# EAGLE design CDST_final_PCB_v1.0 (EAGLE 8.4.2)
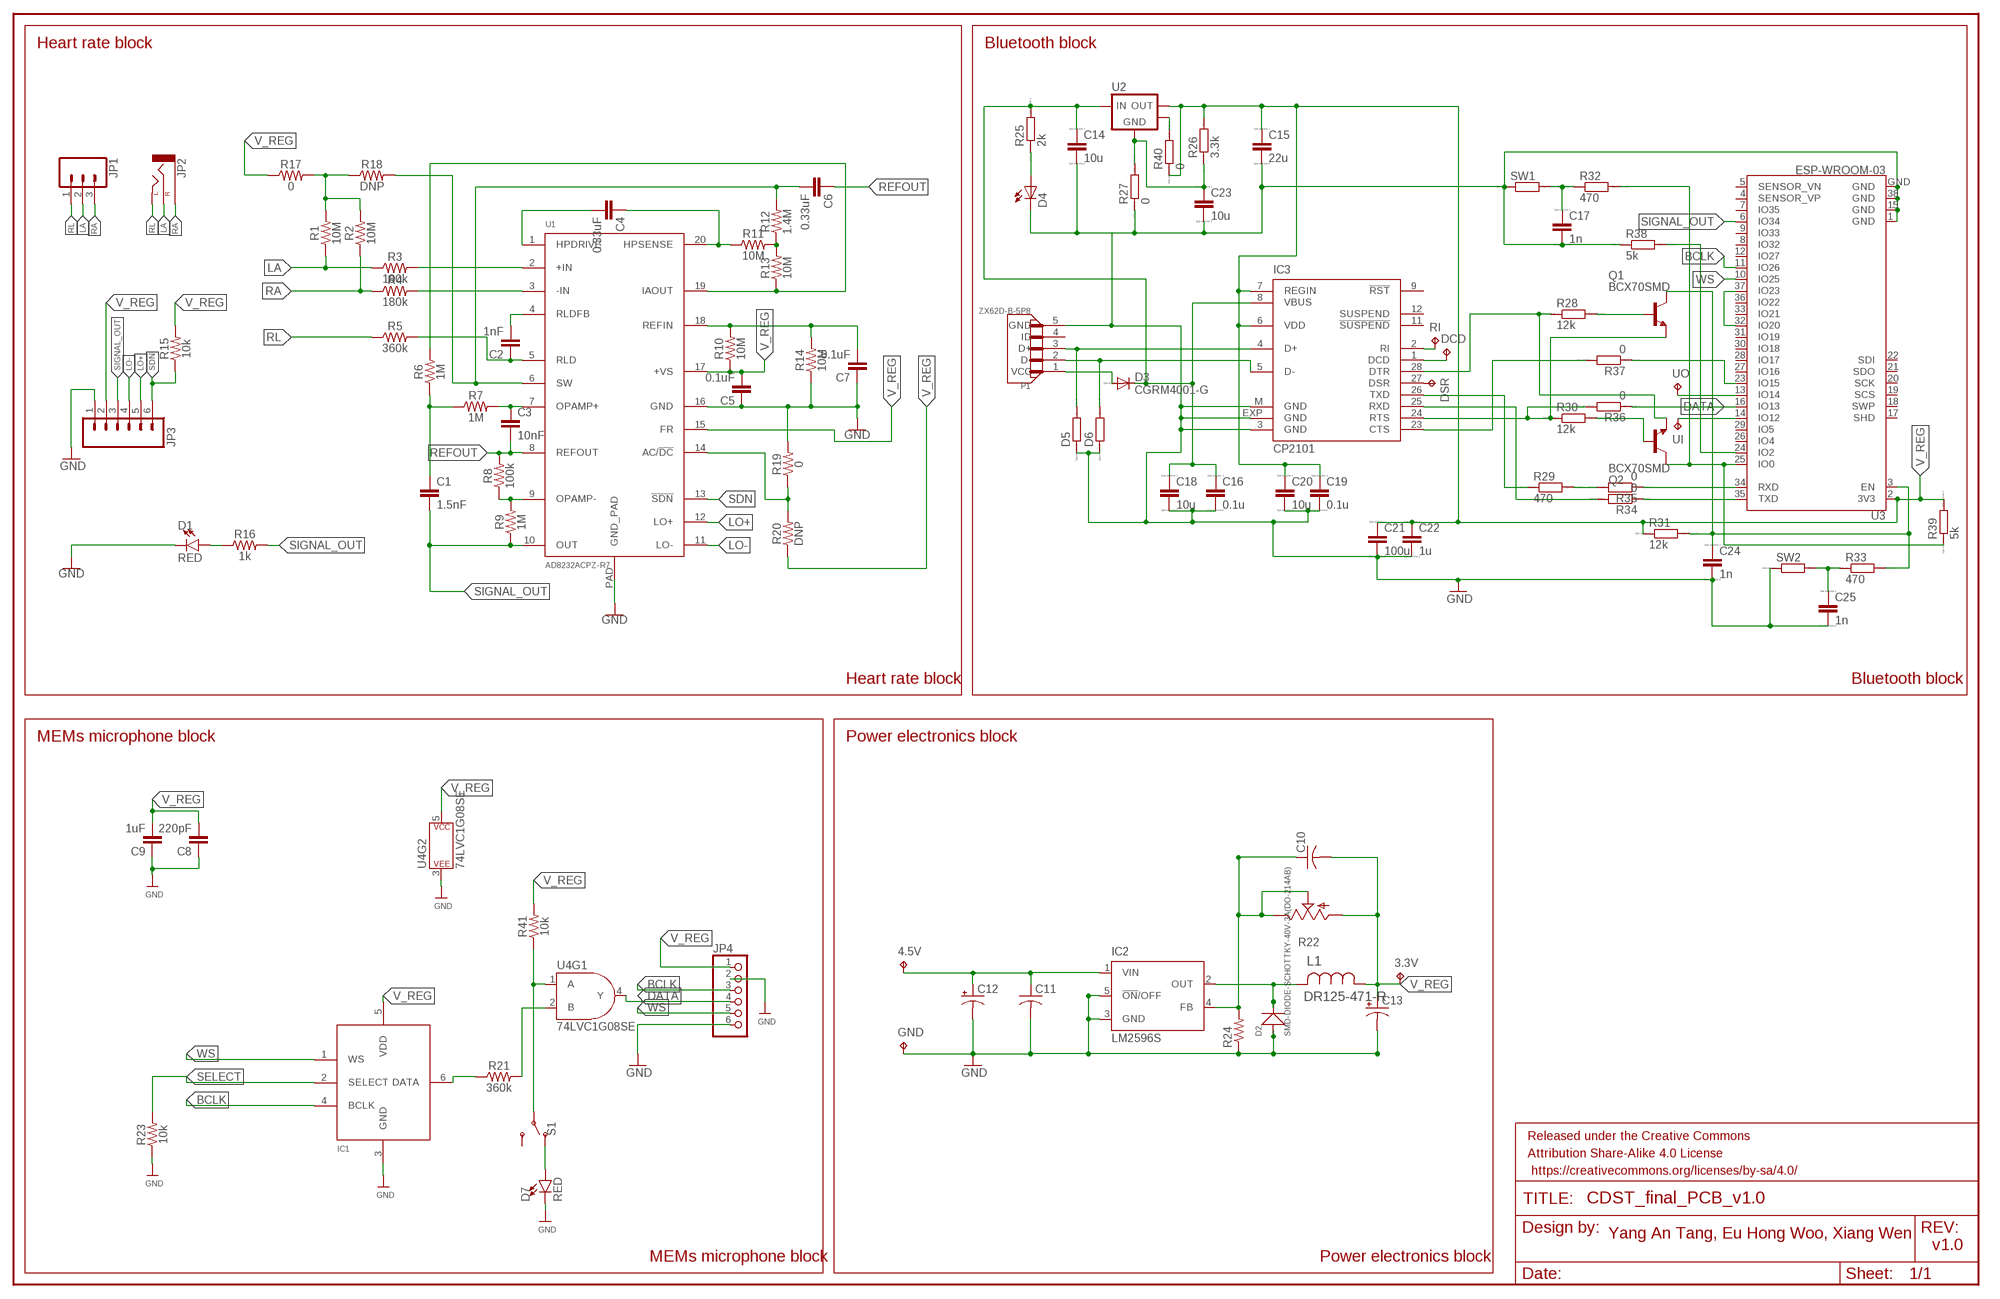
[diagram p0: schematic, sheet 1]

## Parts
3.3V  TPTP20SQ  [TP20SQ]
4.5V  TPTP20SQ  [TP20SQ]
C1  1.5nF  C-EUC1206  [C1206]
C2  1nF  C-EUC1206  [C1206]
C3  10nF  C-EUC1206  [C1206]
C4  0.33uF  C-EUC1206  [C1206]
C5  0.1uF  C-EUC1206  [C1206]
C6  0.33uF  C-EUC1206  [C1206]
C7  0.1uF  C-EUC1206  [C1206]
C8  220pF  C-EUC1206  [C1206]
C9  1uF  C-EUC1206  [C1206]
C10  C-USC0402  [C0402]
C11  C-USC0402  [C0402]
C12  CPOL-USSANYO_SMD_F8  [SANYO-OSCON_SMD_F8]
C13  CPOL-USSANYO_SMD_F8  [SANYO-OSCON_SMD_F8]
C14  10u  CC1206  [C1206]
C15  22u  CC1206  [C1206]
C16  0.1u  CC1206  [C1206]
C17  1n  CC1206  [C1206]
C18  10u  CC1206  [C1206]
C19  0.1u  CC1206  [C1206]
C20  10u  CC1206  [C1206]
C21  100u  CC1206  [C1206]
C22  1u  CC1206  [C1206]
C23  10u  CC1206  [C1206]
C24  1n  CC1206  [C1206]
C25  1n  CC1206  [C1206]
D1  RED  LED-RED1206  [LED-1206]
D2  SMD-DIODE-SCHOTTKY-40V-3A(DO-214AB)  [DO-214AB]
D3  CGRM4001-G  [SOD-123_MINI-SMA]
D4  LEDCHIPLED_0805  [CHIPLED_0805]
D5  RR0402  [R0402]
D6  RR0402  [R0402]
D7  RED  LED-RED1206  [LED-1206]
DCD  TPB2,54  [B2,54]
DSR  TPB2,54  [B2,54]
FRAME1  FRAME-LEDGER  [CREATIVE_COMMONS]
GND  TPTP20SQ  [TP20SQ]
IC1  MIC_I2S_SPH0645  [SPH0645LM4H]
IC2  LM2596S  [TO263-5]
IC3  CP2101  [MLP28]
JP1  M03PTH  [1X03]
JP2  AUDIO-JACKSMD2  [AUDIO-JACK-3.5MM-SMD]
JP3  M06SIP  [1X06]
JP4  HEADER-1X6ROUND  [1X06_ROUND]
L1  DR125-471-R  [INDM125125X600N]
P1  ZX62D-B-5P8  [HRS_ZX62D-B-5P8]
Q1  BCX70SMD  [SOT23]
Q2  BCX70SMD  [SOT23]
R1  10M  RESISTOR1206  [1206]
R2  10M  RESISTOR1206  [1206]
R3  180k  RESISTOR1206  [1206]
R4  180k  RESISTOR1206  [1206]
R5  360k  RESISTOR1206  [1206]
R6  1M  RESISTOR1206  [1206]
R7  1M  RESISTOR1206  [1206]
R8  100k  RESISTOR1206  [1206]
R9  1M  RESISTOR1206  [1206]
R10  10M  RESISTOR1206  [1206]
R11  10M  RESISTOR1206  [1206]
R12  1.4M  RESISTOR1206  [1206]
R13  10M  RESISTOR1206  [1206]
R14  10M  RESISTOR1206  [1206]
R15  10k  RESISTOR1206  [1206]
R16  1k  RESISTOR1206  [1206]
R17  0  RESISTOR1206  [1206]
R18  DNP  RESISTOR1206  [1206]
R19  0  RESISTOR1206  [1206]
R20  DNP  RESISTOR1206  [1206]
R21  360k  RESISTOR1206  [1206]
R22  TRIM_US-RJ9W  [RJ9W]
R23  10k  RESISTOR1206  [1206]
R24  R-US_MELF0204W  [MINI_MELF-0204W]
R25  2k  RR1206  [R1206]
R26  3.3k  RR1206  [R1206]
R27  0  RR1206  [R1206]
R28  12k  RR1206  [R1206]
R29  470  RR1206  [R1206]
R30  12k  RR1206  [R1206]
R31  12k  RR1206  [R1206]
R32  470  RR1206  [R1206]
R33  470  RR1206  [R1206]
R34  0  RR1206  [R1206]
R35  0  RR1206  [R1206]
R36  0  RR1206  [R1206]
R37  0  RR1206  [R1206]
R38  5k  RR1206  [R1206]
R39  5k  RR1206  [R1206]
R40  0  RR1206  [R1206]
R41  10k  RESISTOR1206  [1206]
RI  TPB2,54  [B2,54]
S1  SWITCH-SPDT-SMD-RIGHT-ANGLE  [SWITCH_SPST_SMD_A]
SW1  RR2010  [R2010]
SW2  RR2010  [R2010]
U1  AD8232ACPZ-R7  AD8232  [LFCSP_20]
U2  LM1117-SOT223  [SOT-223-3]
U3  ESP-WROOM-03  [ESP-WROOM-03]
U4  74LVC1G08SE  74LVC08SE  [SOT23-5]
UI  TPB1,27  [B1,27]
UO  TPB1,27  [B1,27]

## Nets
BCLK: IC1.4(BCLK) JP4.3 U3.11(IO26)
DATA: JP4.4 R36.1 U3.16(IO13) U4.4(Y)
DCD: DCD.TP IC3.1(DCD)
GND: C5.1 C7.1 C8.1 C9.1 C11.2 C12.- C13.- C14.2 C15.2 C16.2 C17.2 C18.2 C19.2 C20.2 C21.2 C22.2 C23.1 C23.2 C24.2 C25.2 D1.C D2.1(+) D4.C D5.1 D6.1 D7.C GND.TP IC1.3(GND) IC2.3(GND) IC2.5(!ON!/OFF) IC3.3(GND) IC3.EXP(GND) IC3.M(GND) JP3.1 JP4.2 JP4.6 P1.5(GND) R14.1 R19.2 R23.1 R24.1 R26.1 R27.1 R27.2 R38.1 SW1.1 SW2.1 U1.16(GND) U1.PAD(GND_PAD) U2.1(GND) U3.1(GND) U3.15(GND) U3.38(GND) U3.GND U4.3(P$V-)
HEATSINK: R40.2 U2.4(HEATSINK)
LA: JP1.2 JP2.RING(RIGHT) R1.1 R3.1
LO+: JP3.5 U1.12(LO+)
LO-: JP3.4 U1.11(LO-)
N$1: C4.2 U1.1(HPDRIVE)
N$2: C4.1 R11.1 U1.20(HPSENSE)
N$3: R11.2 R12.1 R13.2
N$4: C6.2 R12.2 R18.2 U1.6(SW)
N$5: C3.1 R7.2 U1.7(OPAMP+)
N$6: 4.5V.TP C11.1 C12.+ IC2.1(VIN)
N$7: R6.2 R13.1 U1.19(IAOUT)
N$8: C1.1 R6.1 R7.1
N$9: D4.A R25.1
N$10: IC1.6(DATA) R21.1
N$11: R8.1 R9.2 U1.9(OPAMP-)
N$12: C10.1 IC2.4(FB) R22.E R22.S R24.2
N$13: R3.2 U1.2(+IN)
N$14: R4.2 U1.3(-IN)
N$15: D1.A R16.1
N$16: R1.2 R2.2 R17.2 R18.1
N$17: C2.2 U1.4(RLDFB)
N$18: C2.1 R5.2 U1.5(RLD)
N$19: C7.2 R10.2 R14.2 U1.18(REFIN)
N$20: C14.1 C16.1 C18.1 D3.C IC3.8(VBUS) R25.2 U2.3(VIN)
N$21: D2.2(-) IC2.2(OUT) L1.2
N$22: R19.1 R20.2 U1.14(AC/!DC)
N$23: D5.2 IC3.4(D+) P1.3(D+)
N$24: D6.2 IC3.5(D-) P1.2(D-)
N$25: D3.A P1.1(VCC)
N$26: Q1.1(B) R28.2
N$27: IC3.24(RTS) Q1.2(E) R30.1 R36.2
N$28: IC3.28(DTR) Q2.2(E) R28.1
N$29: C24.1 Q1.3(C) R31.2 R33.2 U3.3(EN)
N$30: IC3.25(RXD) R34.2
N$31: IC3.26(TXD) R29.1
N$32: U3.13(IO14) UO.TP
N$33: U3.32(IO20) U3.37(IO23)
N$34: C25.1 R33.1 SW2.2
N$35: C17.1 R32.1 SW1.2
N$36: Q2.3(C) R32.2 R39.1 U3.25(IO0)
N$37: R38.2 U3.24(IO2)
N$38: R34.1 U3.35(TXD)
N$39: R29.2 R35.2
N$40: R35.1 U3.34(RXD)
N$41: U3.14(IO12) UI.TP
N$42: IC3.23(CTS) R37.2
N$43: R37.1 U3.23(IO15)
N$44: Q2.1(B) R30.2
N$45: IC3.2(RI) RI.TP
N$46: DSR.TP IC3.27(DSR)
N$47: D7.A S1.1(O)
N$48: R21.2 U4.2(B)
N$49: R41.1 S1.2(P) U4.1(A)
RA: JP1.3 JP2.SLEEVE R2.1 R4.1
REFOUT: C3.2 C6.1 R8.2 U1.8(REFOUT)
RL: JP1.1 JP2.TIP(LEFT) R5.1
SDN: JP3.6 R15.1 U1.13(!SDN)
SELECT: IC1.2(SELECT) R23.2
SIGNAL_OUT: C1.2 JP3.3 R9.1 R16.2 U1.10(OUT) U3.6(IO34)
V_REG: 3.3V.TP C5.2 C8.2 C9.2 C10.2 C13.+ C15.1 C19.1 C20.1 C21.1 C22.1 IC1.5(VDD) IC3.6(VDD) IC3.7(REGIN) JP3.2 JP4.1 L1.1 R10.1 R15.2 R17.1 R20.1 R22.A R26.2 R31.1 R39.2 R40.1 R41.2 U1.15(FR) U1.17(+VS) U2.2(VOUT) U3.2(3V3) U4.5(P$V+)
WS: IC1.1(WS) JP4.5 U3.10(IO25)
Unconnected: IC3.9(!RST) IC3.11(!SUSPEND) IC3.12(SUSPEND) P1.4(ID) S1.3(S) U3.4(SENSOR_VP) U3.5(SENSOR_VN) U3.7(IO35) U3.8(IO32) U3.9(IO33) U3.12(IO27) U3.17(SHD) U3.18(SWP) U3.19(SCS) U3.20(SCK) U3.21(SDO) U3.22(SDI) U3.26(IO4) U3.27(IO16) U3.28(IO17) U3.29(IO5) U3.30(IO18) U3.31(IO19) U3.33(IO21) U3.36(IO22)

## Notes on the sheet
- Heart rate block | Bluetooth block
- Heart rate block | Bluetooth block
- MEMs microphone block | Power electronics block
- Yang An Tang, Eu Hong Woo, Xiang Wen
- v1.0
- MEMs microphone block | Power electronics block

## Library data of the parts
3.3V 4.5V DCD DSR GND RI UI UO = testpad:TP: Test pad
C1-C9 = rcl:C-EU: CAPACITOR, European symbol
C10 C11 = rcl:C-US: CAPACITOR, American symbol
C12 C13 = rcl:CPOL-US: POLARIZED CAPACITOR, American symbol
C14-C25 = eagle-ltspice:C: CAPACITOR, European symbol; SPICEMODEL: NONE; SPICEPREFIX: C
D1 D7 = SparkFun-LED:LED-RED: Red SMD LED Used in manufacturing of most products at SparkFun Packages: 0603 - SMD 0603 package [Product Link] <http://docs.avagotech.com/docs/AV02-0551EN> 0603 SMART - SMD 0603 SMART package ( more efficient and expensive)[Product Link] <http://www.osram-os.com/Graphics/XPic2/00077099_0.pdf> 1206 - SMD1206 package [Product Link] <https://www.sparkfun.com/datasheets/DevTools/LilyPad/Q150OVS4.pdff> SparkFun Products: Pro Mini 328 -5V <https://www.sparkfun.com/products/821> RedBoard <https://www.sparkfun.com/products/12757> IOIO-OTG <https://www.sparkfun.com/products/13613>; PROD_ID: DIO-09912
D2 = SMD-DIODE-SCHOTTKY-40V-3A_DO-214AB_:SMD-DIODE-SCHOTTKY-40V-3A(DO-214AB): 304020018; AVAILABILITY: Good; DESCRIPTION: Rectifier, Schottky; DO-214AB; 3.0A IF; 0.75V; 40V; 100A IFRM; 10000V/us; 1000pF; MF: Vishay; MP: SS34-E3/57T; PACKAGE: DO-214 Vishay; PRICE: 0.24 USD
D3 = diode:CGRM400*-G: Molded plasitc,JEDEC SOD-123/Mini SMA Source: Comchip CGRM4001-G.pdf
D4 = led:LED: LED OSRAM: - CHIPLED LG R971, LG N971, LY N971, LG Q971, LY Q971, LO R971, LY R971 LH N974, LH R974 LS Q976, LO Q976, LY Q976 LO Q996 - Hyper CHIPLED LW Q18S LB Q993, LB Q99A, LB R99A - SideLED LS A670, LO A670, LY A670, LG A670, LP A670 LB A673, LV A673, LT A673, LW A673 LH A674 LY A675 LS A676, LA A676, LO A676, LY A676, LW A676 LS A679, LY A679, LG A679 - Hyper Micro SIDELED® LS Y876, LA Y876, LO Y876, LY Y876 LT Y87S - SmartLED LW L88C, LW L88S LB L89C, LB L89S, LG L890 LS L89K, LO L89K, LY L89K LS L896, LA L896, LO L896, LY L896 - TOPLED LS T670, LO T670, LY T670, LG T670, LP T670 LSG T670, LSP T670, LSY T670, LOP T670, LYG T670 LG T671, LOG T671, LSG T671 LB T673, LV T673, LT T673, LW T673 LH T674 LS T676, LA T676, LO T676, LY T676, LB T676, LH T676, LSB T676, LW T676 LB T67C, LV T67C, LT T67C, LS T67K, LO T67K, LY T67K, LW E67C LS E67B, LA E67B, LO E67B, LY E67B, LB E67C, LV E67C, LT E67C LW T67C LS T679, LY T679, LG T679 LS T770, LO T770, LY T770, LG T770, LP T770 LB T773, LV T773, LT T773, LW T773 LH T774 LS E675, LA E675, LY E675, LS T675 LS T776, LA T776, LO T776, LY T776, LB T776 LHGB T686 LT T68C, LB T68C - Hyper Mini TOPLED® LB M676 - Mini TOPLED Santana® LG M470 LS M47K, LO M47K, LY M47K Source: http://www.osram.convergy.de LUXEON: - LUMILED® LXK2-PW12-R00, LXK2-PW12-S00, LXK2-PW14-U00, LXK2-PW14-V00 LXK2-PM12-R00, LXK2-PM12-S00, LXK2-PM14-U00 LXK2-PE12-Q00, LXK2-PE12-R00, LXK2-PE12-S00, LXK2-PE14-T00, LXK2-PE14-U00 LXK2-PB12-K00, LXK2-PB12-L00, LXK2-PB12-M00, LXK2-PB14-N00, LXK2-PB14-P00, LXK2-PB14-Q00 LXK2-PR12-L00, LXK2-PR12-M00, LXK2-PR14-Q00, LXK2-PR14-R00 LXK2-PD12-Q00, LXK2-PD12-R00, LXK2-PD12-S00 LXK2-PH12-R00, LXK2-PH12-S00 LXK2-PL12-P00, LXK2-PL12-Q00, LXK2-PL12-R00 Source: www.luxeon.com KINGBRIGHT: KA-3528ASYC Source: www.kingbright.com
D5 D6 R25-R40 SW1 SW2 = eagle-ltspice:R: RESISTOR, European symbol; SPICEMODEL: NONE; SPICEPREFIX: R
FRAME1 = SparkFun-Aesthetics:FRAME-LEDGER: Schematic Frame - Ledger Standard 11x14 US Ledger frame
IC1 = microbuilder:MIC_I2S
IC2 = national-semiconductor:LM2596: SIMPLE SWITCHER® Power Converter 150 kHz 3A Step-Down Voltage Regulator Source: http://www.national.com/ds/LM/LM2596.pdf; MF: NATIONAL SEMICONDUCTOR; MPN: LM2596S-ADJ/NOPB; OC_FARNELL: 9494367; OC_NEWARK: 41K3842
IC3 = silabs:CP210*: Single-Chip USB to UART Bridge Source: www.silabs.com .. CP2101.pdf / cp2102.pdf; MF: FARNELL; MPN: CP2102-GM; OC_FARNELL: 9282130; OC_NEWARK: 30K5635
JP1 = SparkFun-Connectors:M03: Header 3 Standard 3-pin 0.1" header. Use with straight break away headers (SKU : PRT-00116), right angle break away headers (PRT-00553), swiss pins (PRT-00743), machine pins (PRT-00117), and female headers (PRT-00115). Molex polarized connector foot print use with SKU : PRT-08232 with associated crimp pins and housings.
JP2 = SparkFun-Connectors:AUDIO-JACK: 3.5mm Audio Jack Simple 3.5mm common PCB mount audio jack. SKU: PRT-08032; PROD_ID: CONN-10353
JP3 = SparkFun-Connectors:M06: Header 6 Standard 6-pin 0.1" header. Use with straight break away headers (SKU : PRT-00116), right angle break away headers (PRT-00553), swiss pins (PRT-00743), machine pins (PRT-00117), and female headers (PRT-00115). Molex polarized connector foot print use with SKU : PRT-08094 with associated crimp pins and housings. NOTES ON THE VARIANTS LOCK and LOCK_LONGPADS... This footprint was designed to help hold the alignment of a through-hole component (i.e. 6-pin header) while soldering it into place. You may notice that each hole has been shifted either up or down by 0.005 of an inch from it's more standard position (which is a perfectly straight line). This slight alteration caused the pins (the squares in the middle) to touch the edges of the holes. Because they are alternating, it causes a "brace" to hold the component in place. 0.005 has proven to be the perfect amount of "off-center" position when using our standard breakaway headers. Although looks a little odd when you look at the bare footprint, once you have a header in there, the alteration is very hard to notice. Also,if you push a header all the way into place, it is covered up entirely on the bottom side. This idea of altering the position of holes to aid alignment will be further integrated into the Sparkfun Library for other footprints. It can help hold any component with 3 or more connection pins.
JP4 = microbuilder:HEADER-1X6: PIN HEADER
L1 = DR125-471-R:DR125-471-R: POWER INDUCTOR; AVAILABILITY: Warning; DESCRIPTION: Inductor Power Shielded Drum Core 473.1u(OCL)H/470uH 20% 100KHz Ferrite 870mA 718mOhm DCR T/R; MF: Cooper Bussmann; MP: DR125-471-R; PACKAGE: Nonstandard Cooper Bussmann; PRICE: 0.88 USD
P1 = ZX62D-B-5P8:ZX62D-B-5P8: Conn Micro USB 2.0 Type B RCP 5 POS 0.65mm Solder RA SMD 5 Terminal 1 Port Embossed T/R; AVAILABILITY: Good; DESCRIPTION: Conn Micro USB 2.0 Type B RCP 5 POS 0.65mm Solder RA SMD 5 Terminal 1 Port Embossed T/R; MF: Hirose; MP: ZX62D-B-5P8; PACKAGE: FakePackage u; PRICE: 1.20 USD
Q1 Q2 = transistor:BCX70SMD: NPN TRANSISTOR
R1-R21 R23 R41 = SparkFun-Resistors:RESISTOR: Generic Resistor Package
R22 = pot:TRIM_US-: POTENTIOMETER
R24 = rcl:R-US_: RESISTOR, American symbol
S1 = SparkFun-Switches:SWITCH-SPDT: Single Pole, Double Throw (SPDT) Switch Single-pole, double-throw (SPDT) switch. Variant Overview SMD-AYZ0202 Surface Mount DPDT Switch <https://www.sparkfun.com/products/597> (COM-00597) Used on e.g. LilyPad Arduino USB - ATmega32U4 Board <https://www.sparkfun.com/products/12049> PTH-11.6X4.0MM SPDT Mini Power Switch <https://www.sparkfun.com/products/102> (COM-00102) Used on e.g. SparkFun Simon Says - Through-Hole Soldering Kit <https://www.sparkfun.com/products/10547> (KIT-10547) PTH-11.6X4.0MM-KIT KIT version of SPDT Mini Power Switch - Simplifies soldering by removing tStop of switch pins - only one side can be soldered. PTH-11.6X4.0MM-LOCK LOCK version of SPDT Mini Power Switch - Offset pins hold switch in place for easier soldering. SMD-RIGHT-ANGLE Surface Mount Right Angle Switch <https://www.sparkfun.com/products/10860> (COM-10860) Used on e.g. SparkFun ESP8266 Thing <https://www.sparkfun.com/products/13231>; PROD_ID: SWCH-10651; SF_SKU: COM-10860
U1 = SparkFun-Sensors:AD8232: AD8232 Single Lead Heart Rate Monitor IC Datasheet <https://cdn.sparkfun.com/datasheets/Sensors/Biometric/AD8232.pdf> SparkFun Products SparkFun Single Lead Heart Rate Monitor - AD8232 <https://www.sparkfun.com/products/12650> (SEN-12650); PROD_ID: IC-11886
U2 = bt_regulator:LM1117: LDO Voltage Regulator NCP1117 Output Current in Excess of 1.0 A 1.2 V Maximum Dropout Voltage at 800 mA Over Temperature Fixed Output Voltages of 1.5, 1.8, 1.9, 2.0, 2.5, 2.85, 3.3, 5.0, and 12 V Adjustable Output Voltage Option No Minimum Load Requirement for Fixed Voltage Output Devices Reference/Output Voltage Trimmed to �1.0% Current Limit, Safe Operating and Thermal Shutdown Protection Operation to 20 V Input NCV Prefix for Automotive and Other Applications Requiring Unique Site and Control Change Requirements; AEC-Q100 Qualified and PPAP Capable datasheet.pdf <http://www.onsemi.com/pub/Collateral/NCP1117-D.PDF> LM1117 Available in 1.8 V, 2.5 V, 3.3 V, 5 V, and adjustable versions Output Current 800 mA Current Limiting and Thermal Protection Space-Saving SOT-223 and WSON Packages Line Regulation 0.2% (Maximum) Load Regulation 0.4% (Maximum) Temperature: LM1117: 0�C to 125�C; LM1117I: -40�C to 125�C LM1117 (Rev. N) is a series of low dropout voltage regulators of 1.2V at 800mA of load current. It has the same pin-out as Texas Instruments' industry standard LM317. The LM1117-N is available in an adjustable version, available in five fixed voltages, 1.8V, 2.5V, 2.85V, 3.3V, and 5V. The LM1117-N offers current limiting and thermal shutdown. Its circuit includes a zener trimmed to within �1%. datasheet.pdf <http://www.ti.com/lit/ds/symlink/lm1117.pdf>
U3 = esp32:ESP-WROOM-03
U4 = SparkFun-IC-Logic:74*08: Single AND gate IC GATE AND SNGL 2INPUT SOT353 SparkFun Products SparkFun LogicBlocks Kit <https://www.sparkfun.com/products/11006> (KIT-11006) SparkFun RedBot Mainboard <https://www.sparkfun.com/products/12097> (ROB-12097); PROD_ID: IC-10841

## Board
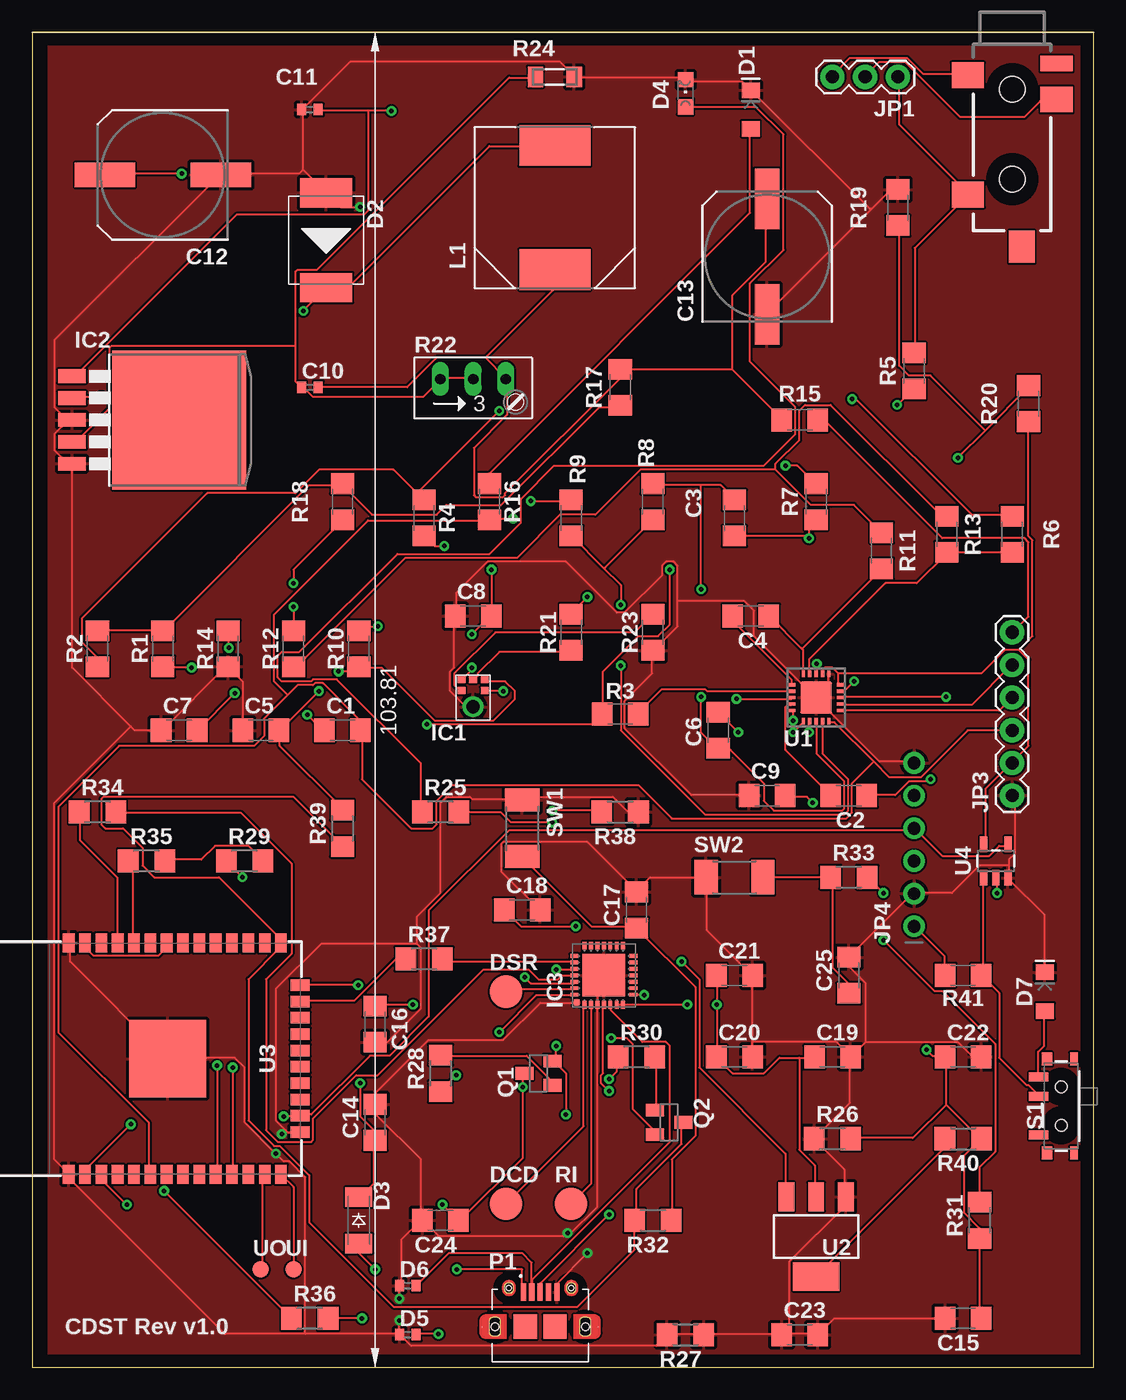
[diagram p1: board, top side]
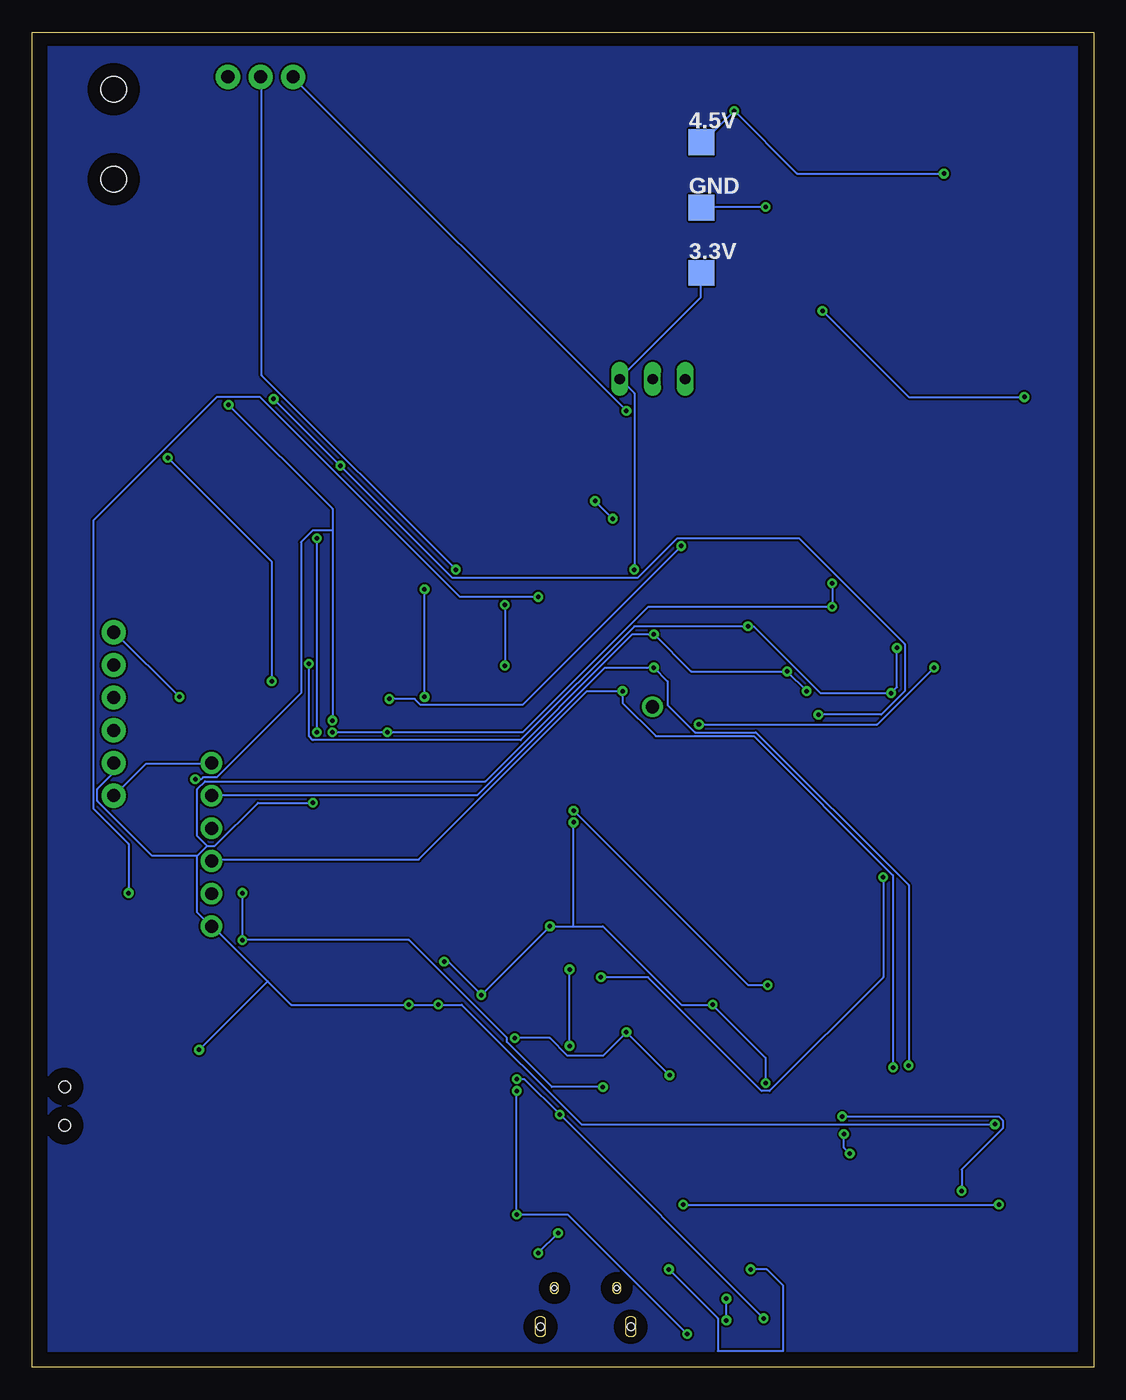
[diagram p2: board, bottom side, seen from below]

Size 82.53 x 103.81 mm. Coordinates in mm from the lower left corner, seen from the top.
Outline: 0,0 82.53,0 82.53,103.81 0,103.81 0,0
Copper layers (1*16): Top 0.035mm / dielectric 1.5mm / Bottom 0.035mm
Design rules "default *": minimum track width 6mil, minimum drill 0.35mm, track to track 6mil, track to pad 6mil, pad to pad 6mil, via to via 6mil, smd to smd 6mil, copper to edge 40mil, drill to drill 6mil, minimum pad ring 10mil, minimum via ring 8mil, stop-mask expansion 4mil, vias tented up to drill 0mil, thermal gap 10mil

### Footprints (pad centres in the part's own frame; a part is rotated, then mirrored left to right if it is on the bottom)
TP20SQ = smd 2 x 2: TP 0,0
C1206 = smd 1.6 x 1.8: 1 -1.4,0; 2 1.4,0
C0402 = smd 0.7 x 0.9: 1 -0.65,0; 2 0.65,0
SANYO-OSCON_SMD_F8 = smd 4.7 x 1.9: + 4.5,0; - -4.5,0
LED-1206 = smd 1.2 x 1.4: A -1.5,0; C 1.5,0
DO-214AB = smd 2.286 x 4.064: 1 -3.683,0; 2 3.683,0
SOD-123_MINI-SMA = smd 1.5 x 2.1: A 1.8,0; C -1.8,0
CHIPLED_0805 = smd 1.2 x 1.2: A 0,-1.05; C 0,1.05
R0402 = smd 0.7 x 0.9: 1 -0.65,0; 2 0.65,0
B2,54 = smd 2.54 x 2.54: TP 0,0
SPH0645LM4H = smd 0.6 x 0.525: 1 -0.9,1.4; 2 -0.9,0.55; 4 0.9,0.55; 5 0.9,1.4; 6 0,1.4 | drill 1.025 pad 1.625: 3 0,-0.71
TO263-5 = smd 1.067 x 2.159: 1 -3.404,-5.791; 2 -1.702,-5.791; 3 0,-5.791; 4 1.702,-5.791; 5 3.404,-5.791 | smd 10.8 x 10.41: 6 0,2.54
MLP28 = smd 0.6 x 0.3: 1 -2.3,1.5; 2 -2.3,1; 3 -2.3,0.5; 4 -2.3,0; 5 -2.3,-0.5; 6 -2.3,-1; 7 -2.3,-1.5; 15 2.3,-1.5; 16 2.3,-1; 17 2.3,-0.5; 18 2.3,0; 19 2.3,0.5; 20 2.3,1; 21 2.3,1.5 | smd 0.3 x 0.6: 8 -1.5,-2.3; 9 -1,-2.3; 10 -0.5,-2.3; 11 0,-2.3; 12 0.5,-2.3; 13 1,-2.3; 14 1.5,-2.3; 22 1.5,2.3; 23 1,2.3; 24 0.5,2.3; 25 0,2.3; 26 -0.5,2.3; 27 -1,2.3; 28 -1.5,2.3 | smd 3.3 x 3.3: EXP 0,0 | smd 0.435 x 0.435: M -2.103,2.103
1X03 = drill 1.016 pad 1.88: 1 0,0; 2 2.54,0; 3 5.08,0
AUDIO-JACK-3.5MM-SMD = smd 2 x 2.5: RING 4.3,3.45; SLEEVE 2.4,-3.45; TIP 11.7,-3.45 | smd 1.2 x 2.5: RSH 1.5,3.45 | smd 2.5 x 2: TSH 15.75,0.75 | hole 2: 3.5,0; 10.5,0
1X06 = drill 1.016 pad 1.88: 1 0,0; 2 2.54,0; 3 5.08,0; 4 7.62,0; 5 10.16,0; 6 12.7,0
1X06_ROUND = drill 1 pad 1.676: 1 -6.35,0; 2 -3.81,0; 3 -1.27,0; 4 1.27,0; 5 3.81,0; 6 6.35,0
INDM125125X600N = smd 3.15 x 5.512: 1 -4.826,0; 2 4.826,0
HRS_ZX62D-B-5P8 = smd 0.4 x 1.35: 1 -1.3,0; 2 -0.65,0; 3 0,0; 4 0.65,0; 5 1.3,0 | smd 0.1 x 0.1: P1 -2.425,0.85; P2 2.425,0.838; P3 -4.513,-2.712; P6 4.513,-2.688 | smd 1.8 x 1.9: P4 -1.15,-2.675; P5 1.15,-2.675 | hole 0.4: -2.425,0.325; 2.425,0.325 | hole 0.6: -3.513,-2.675; 3.513,-2.675
SOT23 = smd 1 x 1.4: 1 -0.95,-1.1; 2 0.95,-1.1; 3 0,1.1
1206 = smd 1.6 x 1.8: 1 -1.4,0; 2 1.4,0
RJ9W = drill 0.813 long: A 2.54,0.635; E -2.54,0.635; S 0,0.635
MINI_MELF-0204W = smd 1.2 x 1.6: 1 -1.5,0; 2 1.5,0
R1206 = smd 1.6 x 1.803: 1 -1.422,0; 2 1.422,0
SWITCH_SPST_SMD_A = smd 0.7 x 1.5: 1 -2.25,-1.75; 2 -0.75,-1.75; 3 2.25,-1.75 | smd 1 x 0.6: GND1 -3.65,1; GND3 3.65,1 | smd 1 x 0.8: GND2 -3.65,-1.1; GND4 3.65,-1.1 | hole 0.9: -1.5,0; 1.5,0
R2010 = smd 1.8 x 2.7: 1 -2.2,0; 2 2.2,0
LFCSP_20 = smd 0.5 x 0.25: 1 -1.85,1; 2 -1.85,0.5; 3 -1.85,0; 4 -1.85,-0.5; 5 -1.85,-1; 11 1.85,-1; 12 1.85,-0.5; 13 1.85,0; 14 1.85,0.5; 15 1.85,1 | smd 0.25 x 0.5: 6 -1,-1.85; 7 -0.5,-1.85; 8 0,-1.85; 9 0.5,-1.85; 10 1,-1.85; 16 1,1.85; 17 0.5,1.85; 18 0,1.85; 19 -0.5,1.85; 20 -1,1.85 | smd 2.5 x 2.5: PAD 0,0
SOT-223-3 = smd 1.219 x 2.235: 1 -2.311,-3.099; 2 0,-3.099; 3 2.311,-3.099 | smd 3.6 x 2.2: 4 0,3.099
ESP-WROOM-03 = smd 0.9 x 1.5: 1 7.7,9; 2 6.43,9; 3 5.16,9; 4 3.89,9; 5 2.62,9; 6 1.35,9; 7 0.08,9; 8 -1.19,9; 9 -2.46,9; 10 -3.73,9; 11 -5,9; 12 -6.27,9; 13 -7.54,9; 14 -8.81,9; 25 -8.81,-9; 26 -7.54,-9; 27 -6.27,-9; 28 -5,-9; 29 -3.73,-9; 30 -2.46,-9; 31 -1.19,-9; 32 0.08,-9; 33 1.35,-9; 34 2.62,-9; 35 3.89,-9; 36 5.16,-9; 37 6.43,-9; 38 7.7,-9 | smd 1.5 x 0.9: 15 -10.3,5.715; 16 -10.3,4.445; 17 -10.3,3.175; 18 -10.3,1.905; 19 -10.3,0.635; 20 -10.3,-0.635; 21 -10.3,-1.905; 22 -10.3,-3.175; 23 -10.3,-4.445; 24 -10.3,-5.715 | smd 6 x 6: GND 0,0
SOT23-5 = smd 0.55 x 1.2: 1 -0.95,-1.3; 2 0,-1.3; 3 0.95,-1.3; 4 0.95,1.3; 5 -0.95,1.3
B1,27 = smd 1.27 x 1.27: TP 0,0

### Placement (x,y rotation side)
3.3V  30.48,85.09 0 bottom
4.5V  30.48,95.25 0 bottom
C1  24.13,49.53 0 top
C2  63.5,44.45 180 top
C3  54.61,66.04 90 top
C4  55.88,58.42 180 top
C5  17.78,49.53 0 top
C6  53.34,49.53 90 top
C7  11.43,49.53 0 top
C8  34.29,58.42 0 top
C9  57.15,44.45 0 top
C10  21.59,76.2 0 top
C11  21.59,97.79 180 top
C12  10.16,92.71 180 top
C13  57.15,86.36 90 top
C14  26.67,19.05 90 top
C15  72.39,3.81 180 top
C16  26.67,26.67 270 top
C17  46.99,35.56 90 top
C18  38.1,35.56 0 top
C19  62.23,24.13 0 top
C20  54.61,24.13 0 top
C21  54.61,30.48 0 top
C22  72.39,24.13 0 top
C23  59.69,2.54 0 top
C24  31.75,11.43 180 top
C25  63.5,30.48 90 top
D1  55.88,97.79 90 top
D2  22.86,87.63 270 top
D3  25.4,11.43 270 top
D4  50.8,99.06 0 top
D5  29.21,2.54 0 top
D6  29.21,6.35 0 top
D7  78.74,29.21 90 top
DCD  36.83,12.7 0 top
DSR  36.83,29.21 0 top
FRAME1  16.51,-10.16 0 top  (outside the outline)
GND  30.48,90.17 0 bottom
IC1  34.29,52.07 0 top
IC2  8.89,73.66 270 top
IC3  44.45,30.48 90 top
JP1  67.31,100.33 180 top
JP2  76.2,102.87 270 top
JP3  76.2,44.45 90 top
JP4  68.58,40.64 90 top
L1  40.64,90.17 90 top
P1  39.5,5.84 0 top
Q1  39.37,22.86 90 top
Q2  49.53,19.05 270 top
R1  10.16,55.88 90 top
R2  5.08,55.88 90 top
R3  45.72,50.8 0 top
R4  30.48,66.04 270 top
R5  68.58,77.47 270 top
R6  76.2,64.77 270 top
R7  60.96,67.31 270 top
R8  48.26,67.31 90 top
R9  41.91,66.04 270 top
R10  25.4,55.88 90 top
R11  66.04,63.5 90 top
R12  20.32,55.88 90 top
R13  71.12,64.77 90 top
R14  15.24,55.88 90 top
R15  59.69,73.66 180 top
R16  35.56,67.31 270 top
R17  45.72,76.2 270 top
R18  24.13,67.31 270 top
R19  67.31,90.17 90 top
R20  77.47,74.93 90 top
R21  41.91,57.15 90 top
R22  34.29,76.2 0 top
R23  48.26,57.15 90 top
R24  40.64,100.33 180 top
R25  31.75,43.18 0 top
R26  62.23,17.78 0 top
R27  50.8,2.54 180 top
R28  31.75,22.86 90 top
R29  16.51,39.37 0 top
R30  46.99,24.13 0 top
R31  73.66,11.43 90 top
R32  48.26,11.43 180 top
R33  63.5,38.1 0 top
R34  5.08,43.18 0 top
R35  8.89,39.37 0 top
R36  21.59,3.81 0 top
R37  30.48,31.75 0 top
R38  45.72,43.18 180 top
R39  24.13,41.91 90 top
R40  72.39,17.78 180 top
R41  72.39,30.48 180 top
RI  41.91,12.7 0 top
S1  80.01,20.32 270 top
SW1  38.1,41.91 270 top
SW2  54.61,38.1 0 top
U1  60.96,52.07 0 top
U2  60.96,10.16 180 top
U3  10.54,24 180 top
U4  74.93,39.37 0 top
UI  20.32,7.62 0 top
UO  17.78,7.62 0 top

### Tracks (layer width: path | path; a pad name or v marks a point on that pad's centre or on a via)
BCLK  (via drill 0.35)
  Top 0.152: v36.63,52.58 35.26,52.58 IC1.4 | v15.6,23.32 15.6,15.09 U3.11
  Bottom 0.152: JP4.3 68.48,39.47 52.48,39.47 39.37,52.58 v36.63,52.58 36.63,51.66 34.04,49.07 26.42,49.07 15.6,38.25 v15.6,23.32
DATA  (via drill 0.35)
  Top 0.152: U4.4 75.79,40.54 75.18,40.54 74.42,39.78 70.76,39.78 68.63,41.91 JP4.4 68.48,41.91 68.33,41.76 37.08,41.76 30.84,35.51 30.84,27.28 27.79,24.23 26.26,24.23 21.69,19.66 20.93,19.66 U3.16 20.78,19.51 v19.56,19.51 | v10.26,13.72 R36.1 | R36.1
  Bottom 0.152: v10.26,13.72 10.26,15.39 7.06,18.59 7.06,19.2 7.37,19.51 v19.56,19.51
DCD
  Top 0.152: DCD.TP 42.88,18.75 42.88,28.04 IC3.1
GND  (via drill 0.35)
  Top 0.152: 2.79,73.61 1.73,72.54 1.73,71.32 2.79,70.26 IC2.5 3.1,54.41 7.67,49.84 | 2.79,73.61 3.1,73.61 IC2.3 2.79,73.61 | C5.1 16.36,49.53 16.36,53.34 15.29,54.41 R14.1 15.14,54.56 10.11,49.53 C7.1 7.98,49.53 7.67,49.84 | 21.08,93.12 21.08,97.69 C11.2 21.08,97.84 24.74,101.5 41.05,101.5 42.11,100.43 R24.1 42.27,100.28 50.65,100.28 50.8,100.13 D4.C 50.8,99.97 55.22,99.97 55.83,99.36 D1.C 55.98,99.21 65.13,90.07 65.28,90.07 | 21.08,93.12 22.76,91.44 D2.1 22.91,91.29 23.98,90.22 v25.5,90.22 | 21.08,93.12 20.78,92.81 14.68,92.81 C12.- 14.53,92.66 1.73,79.86 1.73,74.68 2.79,73.61 | 65.28,90.07 57.2,81.99 C13.- | 65.28,90.07 66.65,91.44 67.26,91.44 R19.2 | 46.99,37.03 43.18,40.84 36.63,40.84 36.47,40.69 36.47,38.56 39.37,35.66 C18.2 | 46.99,37.03 48.06,38.1 SW2.1 52.48,38.1 52.48,33.98 55.98,30.48 | 46.99,37.03 C17.2 | 55.98,30.48 55.98,25.3 | 55.98,25.3 55.98,24.23 C20.2 | C19.2 63.6,24.08 63.6,20.57 60.86,17.83 R26.1 60.86,17.68 63.14,15.39 63.14,13.26 | 64.82,25.3 71.98,25.3 73.05,24.23 73.66,24.23 C22.2 | 64.82,25.3 63.75,24.23 C19.2 | 55.98,25.3 62.54,25.3 63.6,24.23 C19.2 | 64.82,25.3 64.82,29.87 63.6,31.09 63.6,31.85 C25.2 63.6,32 68.48,36.88 JP4.2 68.63,36.88 71.53,36.88 73.66,39.01 75.95,39.01 | 55.98,30.48 C21.2 | IC1.3 34.19,51.51 33.58,51.51 32.51,52.58 32.51,54.1 32.82,54.41 32.82,58.37 C8.1 32.97,58.52 32.97,60.2 35.41,62.64 41.5,62.64 45.47,58.67 46.08,58.67 48.97,61.57 48.97,62.33 49.28,62.64 49.89,62.64 50.19,62.33 50.19,59.59 | C9.1 55.68,44.5 51.26,44.5 46.08,49.68 46.08,51.82 48.21,53.95 48.21,55.63 R23.1 48.36,55.78 50.19,57.61 50.19,59.59
  Top 0.152: U1.PAD 61.93,53.03 61.93,53.8 U1.16 | U1.PAD 61.01,51.97 65.89,47.09 68.48,47.09 JP4.6 | 75.95,39.01 75.95,39.47 76.4,39.93 76.4,44.2 76.25,44.35 JP3.1 | 75.95,39.01 75.95,38.1 U4.3 75.95,37.95 78.69,35.2 78.69,30.79 D7.C | 50.19,59.59 55.37,59.59 56.13,58.83 56.13,56.84 60.86,52.12 U1.PAD | R38.1 46.99,43.28 46.23,43.28 45.16,44.35 38.3,44.35 38.15,44.2 SW1.1 38,44.2 34.19,44.2 34.04,44.35 32.21,44.35 31.75,43.89 31.75,36.88 29.92,35.05 29.92,32.92 | U3.15 19.86,18.29 19.71,18.44 | 19.71,18.44 18.95,19.2 18.95,29.41 22.45,32.92 29.92,32.92 | 29.92,32.92 30.23,32.61 30.23,27.89 27.63,25.3 26.72,25.3 C16.2 | IC3.M 42.27,28.35 39.52,28.35 36.63,25.45 30.84,25.45 26.72,21.34 26.72,20.57 C14.2 26.72,20.42 26.72,19.66 30.23,16.15 30.23,11.43 | IC3.EXP 44.4,30.48 43.94,30.02 43.94,28.19 IC3.3 43.94,28.04 43.94,12.5 41.76,10.31 | 30.23,11.43 28.7,9.91 28.7,6.4 D6.1 28.55,6.25 v28.55,5.33 | 41.76,10.31 41.66,10.21 31.6,10.21 30.38,11.43 C24.2 30.23,11.43 | U3.38 2.95,32.92 2.95,31.55 10.41,24.08 U3.GND 10.57,24.08 15.75,24.08 16.51,23.32 16.51,19.05 v18.95,16.61 19.56,16 20.02,16 21.23,14.78 21.23,2.59 | 58.88,2.59 61.01,2.59 C23.2 61.16,2.59 62.38,3.81 C15.2 | 58.88,2.59 58.42,2.59 C23.1 | 28.55,2.59 21.23,2.59 | 21.23,2.59 14.99,2.59 2.95,14.63 2.95,14.94 U3.1 2.79,15.09 1.73,16.15 1.73,43.89 7.67,49.84 | C23.1 58.27,2.59 52.32,2.59 R27.1 52.17,2.59 49.43,2.59 R27.2 49.28,2.44 48.51,1.68 29.46,1.68 28.7,2.44 D5.1 28.55,2.59 | 28.55,2.59 v28.55,3.66 | v19.41,18.14 19.71,18.44 | 63.14,13.26 63.14,12.5 58.88,8.23 58.88,2.59 | 63.14,13.26 U2.1 | 58.88,2.59 C23.1
  Top 0.152: P1.5 40.8,6.51 v43.18,8.89 | v41.63,10.44 41.76,10.31
  Bottom 0.152: v25.5,90.22 30.38,90.22 GND.TP | JP4.6 68.63,46.94 73.66,46.94 76.1,44.5 JP3.1 | v28.55,3.66 v28.55,5.33 | v19.41,18.14 19.41,17.07 v18.95,16.61 | v43.18,8.89 v41.63,10.44
  pour Top: 1.27,102.87 82.55,102.87 82.55,0 1.27,0
HEATSINK
  Top 0.152: R40.2 70.92,17.68 70.92,17.07 61.01,7.16 U2.4
LA  (via drill 0.35)
  Top 0.152: JP2.RING 79.6,98.45 78.38,98.45 77.16,97.23 72.14,97.23 67.87,101.5 65.89,101.5 64.82,100.43 JP1.2 | v12.39,54.41 10.26,54.41 R1.1 | v30.68,49.99 43.49,49.99 44.25,50.75 R3.1 44.4,50.9 44.4,54.1 47.14,56.84 48.67,56.84 49.58,57.76 v49.58,62.03
  Bottom 0.152: v12.39,54.41 16.82,49.99 v30.68,49.99 | v49.58,62.03 64.67,77.11 64.67,100.28 JP1.2
LO+
  Top 0.152: U1.12 62.84,51.51 73.05,51.51 76.1,54.56 JP3.5
LO-
  Top 0.152: JP3.4 75.18,51.05 62.84,51.05 U1.11
N$1
  Top 0.152: U1.1 59.03,53.19 59.03,53.49 54.61,57.91 54.61,58.37 C4.2
N$2
  Top 0.152: 59.79,55.93 57.35,58.37 C4.1 | 59.79,55.93 59.94,55.78 59.94,53.95 U1.20 | 59.79,55.93 59.94,55.93 66.04,62.03 R11.1
N$3
  Top 0.152: 57.81,69.8 47.3,69.8 43.79,66.29 41.05,66.29 37.69,62.94 29.01,62.94 20.62,54.56 20.32,54.56 R12.1 | 57.81,69.8 60.55,67.06 63.91,67.06 66.04,64.92 R11.2 | 57.81,69.8 57.81,70.26 59.64,72.08 59.64,74.37 60.1,74.83 62.08,74.83 70.61,66.29 71.07,66.29 R13.2
N$4  (via drill 0.35)
  Top 0.152: v59.18,49.38 59.94,50.14 U1.6 | v54.92,49.38 53.39,50.9 C6.2 | v20.32,59.13 R12.2 | v20.32,60.96 20.32,62.03 24.13,65.84 R18.2
  Bottom 0.152: v59.18,49.38 v54.92,49.38 44.4,49.38 34.65,59.13 v20.32,59.13 v20.32,60.96
N$5  (via drill 0.35)
  Top 0.152: v60.4,49.38 60.4,50.14 U1.7 | 60.4,64.62 60.4,65.38 60.86,65.84 R7.2 | 60.4,64.62 54.61,64.62 C3.1 | 60.4,64.62 v60.4,64.47
  Bottom 0.152: v60.4,64.47 v60.4,49.38
N$6  (via drill 0.35)
  Top 0.152: v27.94,97.69 26.11,97.69 | 26.11,97.69 22.3,97.69 C11.1 | 26.11,97.69 26.11,89.92 25.81,89.61 15.9,89.61 3.4,77.11 3.1,77.11 IC2.1 | v11.63,92.81 5.69,92.81 C12.+
  Bottom 0.152: 4.5V.TP 30.38,95.25 v27.94,97.69 23.06,92.81 v11.63,92.81
N$7
  Top 0.152: U1.19 60.4,53.95 60.4,55.02 66.34,60.96 68.78,60.96 71.07,63.25 R13.1 71.22,63.4 76.1,63.4 R6.2
N$8  (via drill 0.35)
  Top 0.152: v21.39,50.75 22.61,49.53 C1.1 | v58.57,70.1 59.49,70.1 60.86,68.73 R7.1 | v63.75,75.29 64.06,75.29 73.05,66.29 76.1,66.29 R6.1
  Bottom 0.152: v21.39,50.75 16.51,50.75 14.68,52.58 14.68,56.24 22.91,64.47 32.36,64.47 35.41,61.42 49.89,61.42 v58.57,70.1 v63.75,75.29
N$9
  Top 0.152: D4.A 50.8,97.99 56.29,97.99 58.42,95.86 58.42,86.87 55.83,84.28 55.83,78.18 59.33,74.68 59.33,72.54 56.9,70.1 40.59,70.1 38,67.51 38,65.68 35.56,63.25 28.4,63.25 20.78,55.63 19.41,55.63 19.1,55.32 19.1,53.65 19.41,53.34 21.69,53.34 21.84,53.49 23.67,53.49 30.23,46.94 30.23,43.28 R25.1
N$10
  Top 0.152: IC1.6 34.34,53.49 34.65,53.8 34.65,53.95 36.32,55.63 41.81,55.63 R21.1
N$11  (via drill 0.35)
  Top 0.152: v45.77,54.56 45.77,49.53 52.32,42.98 63.14,42.98 63.45,43.28 63.45,45.72 61.47,47.7 61.47,50.14 U1.9 | v45.77,59.28 45.77,60.81 44.4,62.18 | 44.4,62.18 41.96,64.62 R9.2 | 44.4,62.18 44.55,62.18 48.21,65.84 R8.1
  Bottom 0.152: v45.77,59.28 v45.77,54.56
N$12
  Top 0.152: 20.47,79.4 20.47,76.66 C10.1 21.08,76.2 21.84,75.44 30.38,75.44 31.75,76.81 R22.E 31.75,76.96 34.19,76.96 R22.S | 20.47,79.4 20.47,85.19 20.62,85.34 22.15,85.34 37.08,100.28 39.07,100.28 R24.2 | 20.47,79.4 6.15,79.4 5.99,79.25 5.99,74.52 3.56,72.08 3.1,72.08 IC2.4
N$13
  Top 0.152: U1.2 59.03,52.58 52.48,52.58 52.32,52.73 48.97,52.73 47.14,50.9 R3.2
N$14  (via drill 0.35)
  Top 0.152: v54.76,51.97 59.03,51.97 U1.3 | v32.05,63.86 31.29,63.86 30.53,64.62 R4.2
  Bottom 0.152: v54.76,51.97 52.78,51.97 52.32,51.51 44.4,51.51 v32.05,63.86
N$15
  Top 0.152: R16.1 35.56,69.49 55.83,89.76 55.83,96.16 D1.A
N$16
  Top 0.152: R2.2 5.08,57.3 10.11,57.3 R1.2 10.26,57.3 21.54,68.58 24.13,68.58 | 24.13,68.58 26.42,66.29 31.45,66.29 32.21,67.06 36.47,67.06 44.09,74.68 45.62,74.68 R17.2 | 24.13,68.58 R18.1
N$17
  Top 0.152: U1.4 59.03,51.51 58.73,51.51 58.57,51.36 58.57,48.01 62.08,44.5 C2.2
N$18  (via drill 0.35)
  Top 0.152: v59.18,50.29 59.18,51.05 U1.5 | v67.26,74.83 68.48,76.05 R5.2 | v69.85,45.72 69.7,45.57 68.17,45.57 67.11,44.5 64.97,44.5 C2.1
  Bottom 0.152: 59.18,65.08 59.18,66.75 v67.26,74.83 | 59.18,65.08 v59.18,50.29 | v69.85,45.72 69.39,45.72 69.24,45.87 68.17,45.87 61.62,52.43 61.62,64.16 60.71,65.08 59.18,65.08
N$19  (via drill 0.35)
  Top 0.152: v61.01,54.71 61.01,53.95 U1.18 | v26.87,57.61 25.81,57.61 25.5,57.3 R10.2 | v15.75,52.43 12.85,49.53 C7.2 | v15.29,55.93 15.29,57.15 R14.2
  Bottom 0.152: v61.01,54.71 61.01,49.07 60.71,48.77 44.55,48.77 35.71,57.61 v26.87,57.61 26.42,57.61 21.23,52.43 v15.75,52.43 15.29,52.88 v15.29,55.93
N$20  (via drill 0.35)
  Top 0.152: D3.C 25.5,13.26 26.57,14.33 26.57,17.53 C14.1 26.57,17.68 26.57,18.44 25.5,19.51 v25.5,22.1 | v47.6,28.96 46.84,28.96 IC3.8 | v42.27,34.29 38,34.29 36.78,35.51 C18.1 | v29.62,28.19 26.72,28.19 C16.1 | v40.44,42.37 37.24,42.37 36.47,43.13 33.27,43.13 R25.2 | v50.5,31.55 51.87,30.18 51.87,23.32 58.57,16.61 58.57,13.26 U2.3
  Bottom 0.152: 40.44,34.29 v42.27,34.29 v47.6,28.96 50.19,31.55 v50.5,31.55 | 40.44,34.29 38.15,34.29 32.05,28.19 v29.62,28.19 25.5,24.08 v25.5,22.1 | 40.44,34.29 v40.44,42.37
N$21  (via drill 0.35)
  Top 0.152: v5.38,75.44 3.1,75.44 IC2.2 | v21.08,82.14 22.76,83.82 D2.2 22.91,83.97 24.59,83.97 35.56,94.94 40.59,94.94 L1.2
  Bottom 0.152: v5.38,75.44 14.38,75.44 v21.08,82.14
N$22  (via drill 0.35)
  Top 0.152: v63.91,53.34 63.14,52.58 62.84,52.58 U1.14 | 74.12,72.85 77.47,76.2 R20.2 | 74.12,72.85 v71.98,70.71 | 74.12,72.85 69.85,77.11 68.17,77.11 67.41,77.88 67.41,88.7 R19.1
  Bottom 0.152: v63.91,53.34 63.91,62.64 v71.98,70.71
N$23  (via drill 0.35)
  Top 0.152: v44.86,21.49 44.25,22.1 44.25,22.71 44.4,22.86 44.4,28.04 IC3.4 | v44.86,11.89 39.52,6.55 39.52,5.94 P1.3 | v31.6,2.59 29.92,2.59 D5.2
  Bottom 0.152: v44.86,21.49 v44.86,11.89 40.89,11.89 v31.6,2.59
N$24
  Top 0.152: IC3.5 45.01,28.04 45.01,27.74 47.45,25.3 49.28,25.3 49.58,24.99 49.58,17.53 38.91,6.86 38.91,5.94 P1.2 38.85,8.14 38.1,8.89 32.4,8.89 D6.2 29.92,6.4
N$25  (via drill 0.35)
  Top 0.152: P1.1 38.1,5.94 38.1,7.62 v33.02,7.62 | v26.67,7.62 25.4,8.89 D3.A
  Bottom 0.152: v33.02,7.62 29.21,3.81 29.21,1.27 24.13,1.27 24.13,6.35 25.4,7.62 v26.67,7.62
N$26
  Top 0.152: Q1.1 40.44,21.95 40.44,22.25 38.46,24.23 31.75,24.23 R28.2
N$27  (via drill 0.35)
  Top 0.152: v40.74,30.94 42.11,30.94 IC3.24 | v40.74,24.99 40.74,24.08 40.59,23.93 Q1.2 40.59,23.77 41.5,22.86 v41.5,19.66 | v25.65,3.81 R36.2 | v44.86,22.4 45.47,23.01 45.47,24.08 R30.1
  Bottom 0.152: v40.74,24.99 v40.74,30.94 | v25.65,3.81 v41.5,19.66 44.25,22.4 v44.86,22.4
N$28  (via drill 0.35)
  Top 0.152: v36.32,26.06 39.22,28.96 42.11,28.96 IC3.28 | v32.97,22.71 31.75,21.49 R28.1 | v45.01,25.6 46.23,25.6 46.69,25.15 46.69,20.12 48.36,18.44 48.36,18.14 Q2.2
  Bottom 0.152: v32.97,22.71 v36.32,26.06 38.15,24.23 40.89,24.23 42.27,25.6 v45.01,25.6
N$29  (via drill 0.35)
  Top 0.152: R31.2 73.66,15.54 74.88,16.76 74.88,25.15 70.76,29.26 70.16,29.26 v66.19,33.22 | v66.19,36.88 64.97,38.1 R33.2 | Q1.3 38.15,22.86 v38.15,21.79 38.15,16.31 33.27,11.43 C24.1 33.12,11.43 v31.9,12.65 | v7.37,12.65 5.38,14.63 5.38,14.94 U3.3
  Bottom 0.152: v66.19,36.88 v66.19,33.22 53.24,33.22 45.62,25.6 45.62,25.3 42.11,21.79 v38.15,21.79 | v31.9,12.65 v7.37,12.65
N$30
  Top 0.152: IC3.25 41.2,30.48 40.89,30.18 39.37,30.18 38.61,30.94 35.1,30.94 26.87,22.71 25.2,22.71 21.84,19.36 21.84,17.68 21.69,17.53 19.1,17.53 18.19,18.44 18.19,30.18 20.17,32.16 20.17,39.17 16.21,43.13 6.6,43.13 R34.2
N$31  (via drill 0.35)
  Top 0.152: v38.3,30.33 38.76,29.87 42.11,29.87 IC3.26 | v16.36,38.1 15.14,39.32 R29.1
  Bottom 0.152: v38.3,30.33 34.65,30.33 25.81,21.49 25.2,21.49 16.36,30.33 v16.36,38.1
N$32
  Top 0.152: UO.TP 17.88,7.62 17.88,14.78 18.03,14.94 U3.13
N$33
  Top 0.152: U3.37 4.17,32.92 4.17,32.61 4.78,32 9.8,32 10.41,32.61 10.41,32.92 U3.32
N$34
  Top 0.152: C25.1 63.45,29.11 63.45,29.87 62.23,31.09 62.23,38.1 R33.1 SW2.2
N$35
  Top 0.152: SW1.2 38.15,39.62 43.49,34.29 46.99,34.29 C17.1 46.99,34.14 51.56,29.57 51.56,17.98 49.73,16.15 49.73,11.43 R32.1
N$36
  Top 0.152: Q2.3 50.5,19.05 50.5,17.37 46.99,13.87 46.99,11.43 R32.2 | R39.1 24.13,40.54 20.32,44.35 5.54,44.35 5.38,44.2 5.38,42.22 5.69,41.91 7.06,41.91 8.59,40.39 8.59,39.01 9.5,38.1 14.53,38.1 19.25,33.38 19.25,33.07 U3.25 19.25,32.92 19.25,32.61 16.82,30.18 16.82,19.2 18.8,17.22 19.25,17.22 21.54,14.94 21.54,11.28 28.09,4.72 42.42,4.72 46.84,9.14 R32.2 | R32.2
N$37  (via drill 0.35)
  Top 0.152: v25.35,29.72 U3.24 | v40.44,43.28 44.25,43.28 R38.2
  Bottom 0.152: v25.35,29.72 26.87,29.72 v40.44,43.28
N$38
  Top 0.152: U3.35 6.6,33.07 6.6,38.1 3.71,41 3.71,43.13 R34.1
N$39
  Top 0.152: R35.2 10.41,39.47 13.16,39.47 14.22,40.54 16.82,40.54 17.88,39.47 R29.2
N$40
  Top 0.152: U3.34 7.82,33.07 7.82,39.01 7.52,39.32 R35.1
N$41
  Top 0.152: UI.TP 20.32,14.02 19.41,14.94 U3.14
N$42
  Top 0.152: IC3.23 42.11,31.55 32.05,31.55 31.9,31.7 R37.2
N$43
  Top 0.152: U3.23 20.93,28.5 25.04,28.5 28.25,31.7 29.01,31.7 R37.1
N$44
  Top 0.152: Q2.1 48.51,20.12 48.51,24.08 R30.2
N$45
  Top 0.152: IC3.2 43.49,28.04 43.49,14.33 41.96,12.8 RI.TP
N$46
  Top 0.152: IC3.27 42.11,29.41 37.08,29.41 36.93,29.26 DSR.TP
N$47
  Top 0.152: D7.A 78.69,27.58 78.69,24.99 78.23,24.54 78.23,22.71 S1.1
N$48  (via drill 0.35)
  Top 0.152: v75.03,36.88 75.03,37.95 U4.2 | v43.18,59.89 41.96,58.67 R21.2
  Bottom 0.152: v75.03,36.88 75.03,40.69 77.77,43.43 77.77,65.84 68.17,75.44 64.82,75.44 49.28,59.89 v43.18,59.89
N$49
  Top 0.152: 73.81,30.48 73.96,30.63 73.96,37.95 U4.1 | 73.81,30.48 75.18,29.11 75.18,24.08 77.32,21.95 77.47,21.95 78.23,21.18 S1.2 | 73.81,30.48 R41.1
N$50
  pour Bottom: 1.27,102.87 81.28,102.87 81.28,1.27 1.27,1.27
RA  (via drill 0.35)
  Top 0.152: JP2.SLEEVE 72.75,100.58 69.24,100.58 68.02,101.8 63.6,101.8 62.23,100.43 JP1.3 | R2.1 5.08,55.17 3.86,56.39 3.86,58.22 13.61,67.97 20.47,67.97 22.3,69.8 28.09,69.8 29.92,67.97 | 29.92,67.97 30.38,67.51 R4.1 29.92,67.97 | 29.92,67.97 v36.32,74.37
  Bottom 0.152: v36.32,74.37 62.23,100.28 JP1.3
REFOUT  (via drill 0.35)
  Top 0.152: 52.02,68.58 53.54,68.58 54.61,67.51 C3.2 | 52.02,68.58 48.36,68.58 R8.2 | U1.8 61.01,50.14 61.01,47.7 63.14,45.57 63.14,43.43 62.99,43.28 57.66,43.28 56.9,44.04 56.9,45.41 54.3,48.01 53.39,48.01 C6.1 53.24,48.16 52.02,49.38 v52.02,52.12 | v52.02,60.5 52.02,68.58
  Bottom 0.152: v52.02,52.12 v52.02,60.5
RL
  Top 0.152: R5.1 68.63,78.94 68.63,87.02 72.75,91.14 JP2.TIP 72.75,91.29 67.41,96.62 67.41,100.28 JP1.1
SDN  (via drill 0.35)
  Top 0.152: v71.07,52.12 62.84,52.12 U1.13 | R15.1 61.16,73.61 61.62,73.61 70.76,64.47 77.16,64.47 77.47,64.16 77.47,58.37 76.25,57.15 JP3.6
  Bottom 0.152: v71.07,52.12 76.1,57.15 JP3.6
SELECT
  Top 0.152: IC1.2 33.27,52.73 33.12,52.73 32.82,53.03 32.82,53.95 36.02,57.15 46.84,57.15 48.21,58.52 R23.2
SIGNAL_OUT  (via drill 0.35)
  Top 0.152: 65.43,47.09 66.65,45.87 69.09,45.87 72.75,49.53 JP3.3 | 65.43,47.09 62.38,50.14 62.08,50.14 U1.10 | 19.86,52.27 20.62,53.03 21.84,53.03 22,53.19 22.61,53.19 25.5,50.29 25.5,49.53 C1.2 25.65,49.53 25.65,45.72 29.46,41.91 31.14,41.91 31.45,42.22 31.45,44.04 32.66,45.26 47.14,45.26 49.73,42.67 63.3,42.67 63.75,43.13 63.75,45.41 65.43,47.09 | 19.86,52.27 18.03,50.44 18.03,49.07 17.27,48.31 6.76,48.31 2.03,43.59 2.03,26.06 9.04,19.05 9.04,15.09 U3.6 | 19.86,52.27 18.8,53.34 18.8,58.52 26.11,65.84 35.56,65.84 R16.2 35.56,65.99 v37.39,65.99 | v38.76,67.36 41.81,67.36 R9.1
  Bottom 0.152: v37.39,65.99 v38.76,67.36
V_REG  (via drill 0.35)
  Top 0.152: 54.46,77.57 45.77,77.57 R17.1 45.62,77.57 45.62,76.81 36.78,67.97 36.78,67.82 36.63,67.67 34.49,67.67 34.34,67.82 34.34,71.48 36.93,74.07 36.93,76.81 R22.A 36.78,76.96 35.26,78.49 | 54.46,77.57 58.27,73.76 R15.2 | 54.46,77.57 54.46,83.36 57.05,85.95 57.05,90.83 C13.+ | 19.25,49.53 19.25,48.31 24.13,43.43 R39.2 | IC1.5 35.26,53.34 36.78,53.34 37.54,52.58 37.54,51.97 35.87,50.29 31.29,50.29 27.18,54.41 25.5,54.41 R10.1 25.35,54.41 25.04,54.1 v23.82,54.1 | v22.3,52.58 19.25,49.53 | 19.25,49.53 C5.2 | C10.2 29.16,76.2 31.45,78.49 35.26,78.49 | v35.71,62.03 35.71,58.52 C8.2 35.56,58.37 v34.19,57 | 35.26,78.49 40.59,83.82 40.59,85.34 L1.1 | 62.69,53.95 62.23,54.41 61.62,54.41 61.47,54.25 61.47,53.95 U1.17 | 62.69,53.95 62.69,53.19 U1.15 | U4.5 74.12,40.69 74.12,44.96 76.1,46.94 JP3.2 76.25,47.09 77.47,48.31 77.47,55.02 76.71,55.78 | 62.69,53.95 73.81,53.95 75.64,55.78 76.71,55.78 | R20.1 77.47,64.62 77.77,64.31 77.77,56.84 76.71,55.78 | C15.1 73.66,3.81 R31.1 73.66,10.82 72.44,12.04 72.44,16.46 73.66,17.68 R40.1 73.66,17.83 71.07,20.42 | 71.07,20.42 71.07,24.08 C22.1 70.92,24.23 70,24.23 v69.55,24.69 | 71.07,20.42 68.48,17.83 63.75,17.83 R26.2 | C21.1 53.24,30.48 v53.24,28.19 53.24,24.23 C20.1 53.24,24.08 54.46,22.86 56.9,22.86 58.12,24.08 59.64,24.08 | 59.64,24.08 60.71,24.08 C19.1 | 59.64,24.08 59.64,16.92 60.86,15.7 60.86,13.26 U2.2 | IC3.6 45.47,28.19 45.92,28.19 IC3.7 46.08,28.19 v50.95,28.19 | v7.67,18.9 4.17,15.39 4.17,15.09 U3.2 | R41.2 70.92,30.48 70.92,32 68.63,34.29 JP4.1 | v60.71,43.89 60.25,44.35 58.57,44.35 C9.2
  Bottom 0.152: v22.3,52.58 v23.82,54.1 31.29,54.1 v34.19,57 35.87,57 47.3,45.57 69.09,45.57 69.7,44.96 69.7,41.3 68.94,40.54 | v35.71,62.03 35.71,75.74 36.78,76.81 R22.A 36.78,76.96 30.53,83.21 30.53,85.04 3.3V.TP | 64.21,30.02 68.48,34.29 JP4.1 68.63,34.29 69.7,35.36 69.7,39.78 | 64.21,30.02 62.38,28.19 v53.24,28.19 v50.95,28.19 49.12,28.19 39.83,18.9 v7.67,18.9 | v60.71,43.89 64.97,43.89 68.33,40.54 68.94,40.54 | 69.7,39.78 68.94,40.54 | 64.21,30.02 v69.55,24.69 | 69.7,39.78 73.2,39.78 77.47,44.04 77.47,44.96 76.25,46.18 76.25,46.94 JP3.2
WS  (via drill 0.35)
  Top 0.152: v34.19,54.41 34.19,54.25 33.43,53.49 IC1.1 | v14.38,23.47 14.38,15.09 U3.10
  Bottom 0.152: JP4.5 68.48,44.5 47.9,44.5 38,54.41 v34.19,54.41 33.12,53.34 33.12,51.51 30.99,49.38 26.26,49.38 14.38,37.49 v14.38,23.47

### Text on the board
tPlace: CDST Rev v1.0